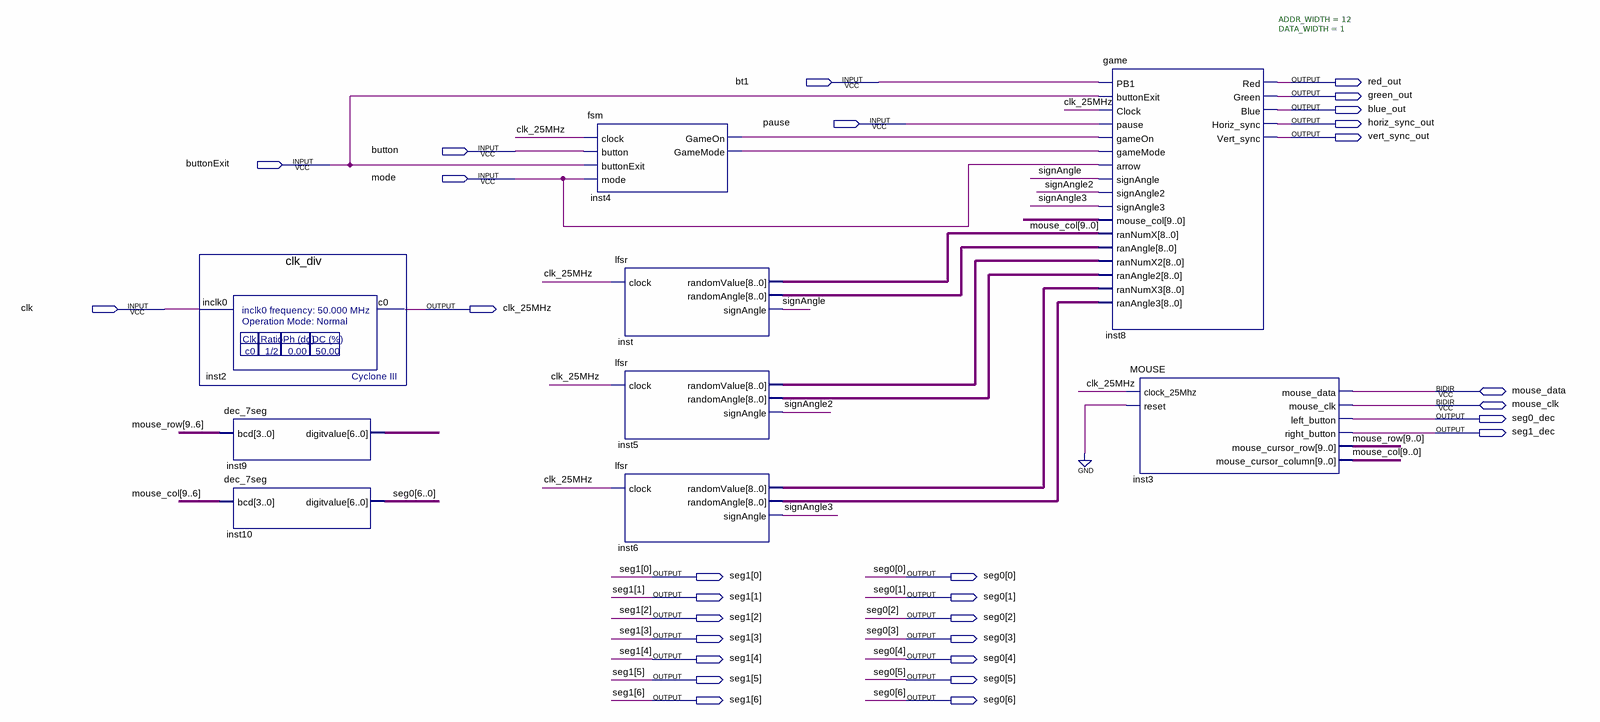
[diagram p0: schematic sheet]
// Quartus schematic UniPong.bdf as structural Verilog: 9 symbols, 30 pins
module UniPong (
  input  bt1,
  input  pause,
  input  button,
  input  buttonExit,
  input  mode,
  input  clk,
  inout  mouse_data,
  inout  mouse_clk,
  output red_out,
  output green_out,
  output blue_out,
  output horiz_sync_out,
  output vert_sync_out,
  output clk_25MHz,
  output seg0_dec,
  output seg1_dec,
  output [6:0] seg1,
  output [6:0] seg0
);

  wire inst4_gamemode, inst4_gameon, signAngle, signAngle2, signAngle3;
  wire [6:0] inst9_digitvalue;
  wire [8:0] inst5_randomangle, inst5_randomvalue, inst6_randomangle, inst6_randomvalue, inst_randomangle,
       inst_randomvalue;
  wire [9:0] mouse_col, mouse_row;

  clk_div inst2 (.inclk0(clk), .c0(clk_25MHz));
  dec_7seg inst9 (.bcd(mouse_row[9:6]), .digitvalue(inst9_digitvalue));
  dec_7seg inst10 (.bcd(mouse_col[9:6]), .digitvalue(seg0));
  fsm inst4 (
    .clock(clk_25MHz), .button(button), .buttonExit(buttonExit), .mode(mode), .GameOn(inst4_gameon),
    .GameMode(inst4_gamemode));
  lfsr inst (.clock(clk_25MHz), .randomValue(inst_randomvalue), .randomAngle(inst_randomangle), .signAngle(signAngle));
  lfsr inst5 (
    .clock(clk_25MHz), .randomValue(inst5_randomvalue), .randomAngle(inst5_randomangle),
    .signAngle(signAngle2));
  lfsr inst6 (
    .clock(clk_25MHz), .randomValue(inst6_randomvalue), .randomAngle(inst6_randomangle),
    .signAngle(signAngle3));
  game #(.ADDR_WIDTH(12), .DATA_WIDTH(1)) inst8 (
    .PB1(bt1), .buttonExit(buttonExit), .Clock(clk_25MHz), .pause(pause), .gameOn(inst4_gameon),
    .gameMode(inst4_gamemode), .arrow(mode), .signAngle(signAngle), .signAngle2(signAngle2),
    .signAngle3(signAngle3), .mouse_col(mouse_col), .ranNumX(inst_randomvalue), .ranAngle(inst_randomangle),
    .ranNumX2(inst5_randomvalue), .ranAngle2(inst5_randomangle), .ranNumX3(inst6_randomvalue),
    .ranAngle3(inst6_randomangle), .Red(red_out), .Green(green_out), .Blue(blue_out),
    .Horiz_sync(horiz_sync_out), .Vert_sync(vert_sync_out));
  MOUSE inst3 (
    .clock_25Mhz(clk_25MHz), .reset(1'b0), .left_button(seg0_dec), .right_button(seg1_dec),
    .mouse_cursor_row(mouse_row), .mouse_cursor_column(mouse_col), .mouse_data(mouse_data),
    .mouse_clk(mouse_clk));
endmodule
